# EasyEDA Pro project ProPrj_智能视觉集成板-V3.0.epro, schematic 双驱

## Sheets
1 母驱 连接器: Board Name: 双驱板; Create Date: 2025-04-21; Page Name: 母驱 连接器; Project Name: 009-智能视觉集成板-V2.0; Schematic Name: 双驱; Update Date: 2025-05-03; Company: 嘉立创EDA; Page Size: A4; Version: V1.0
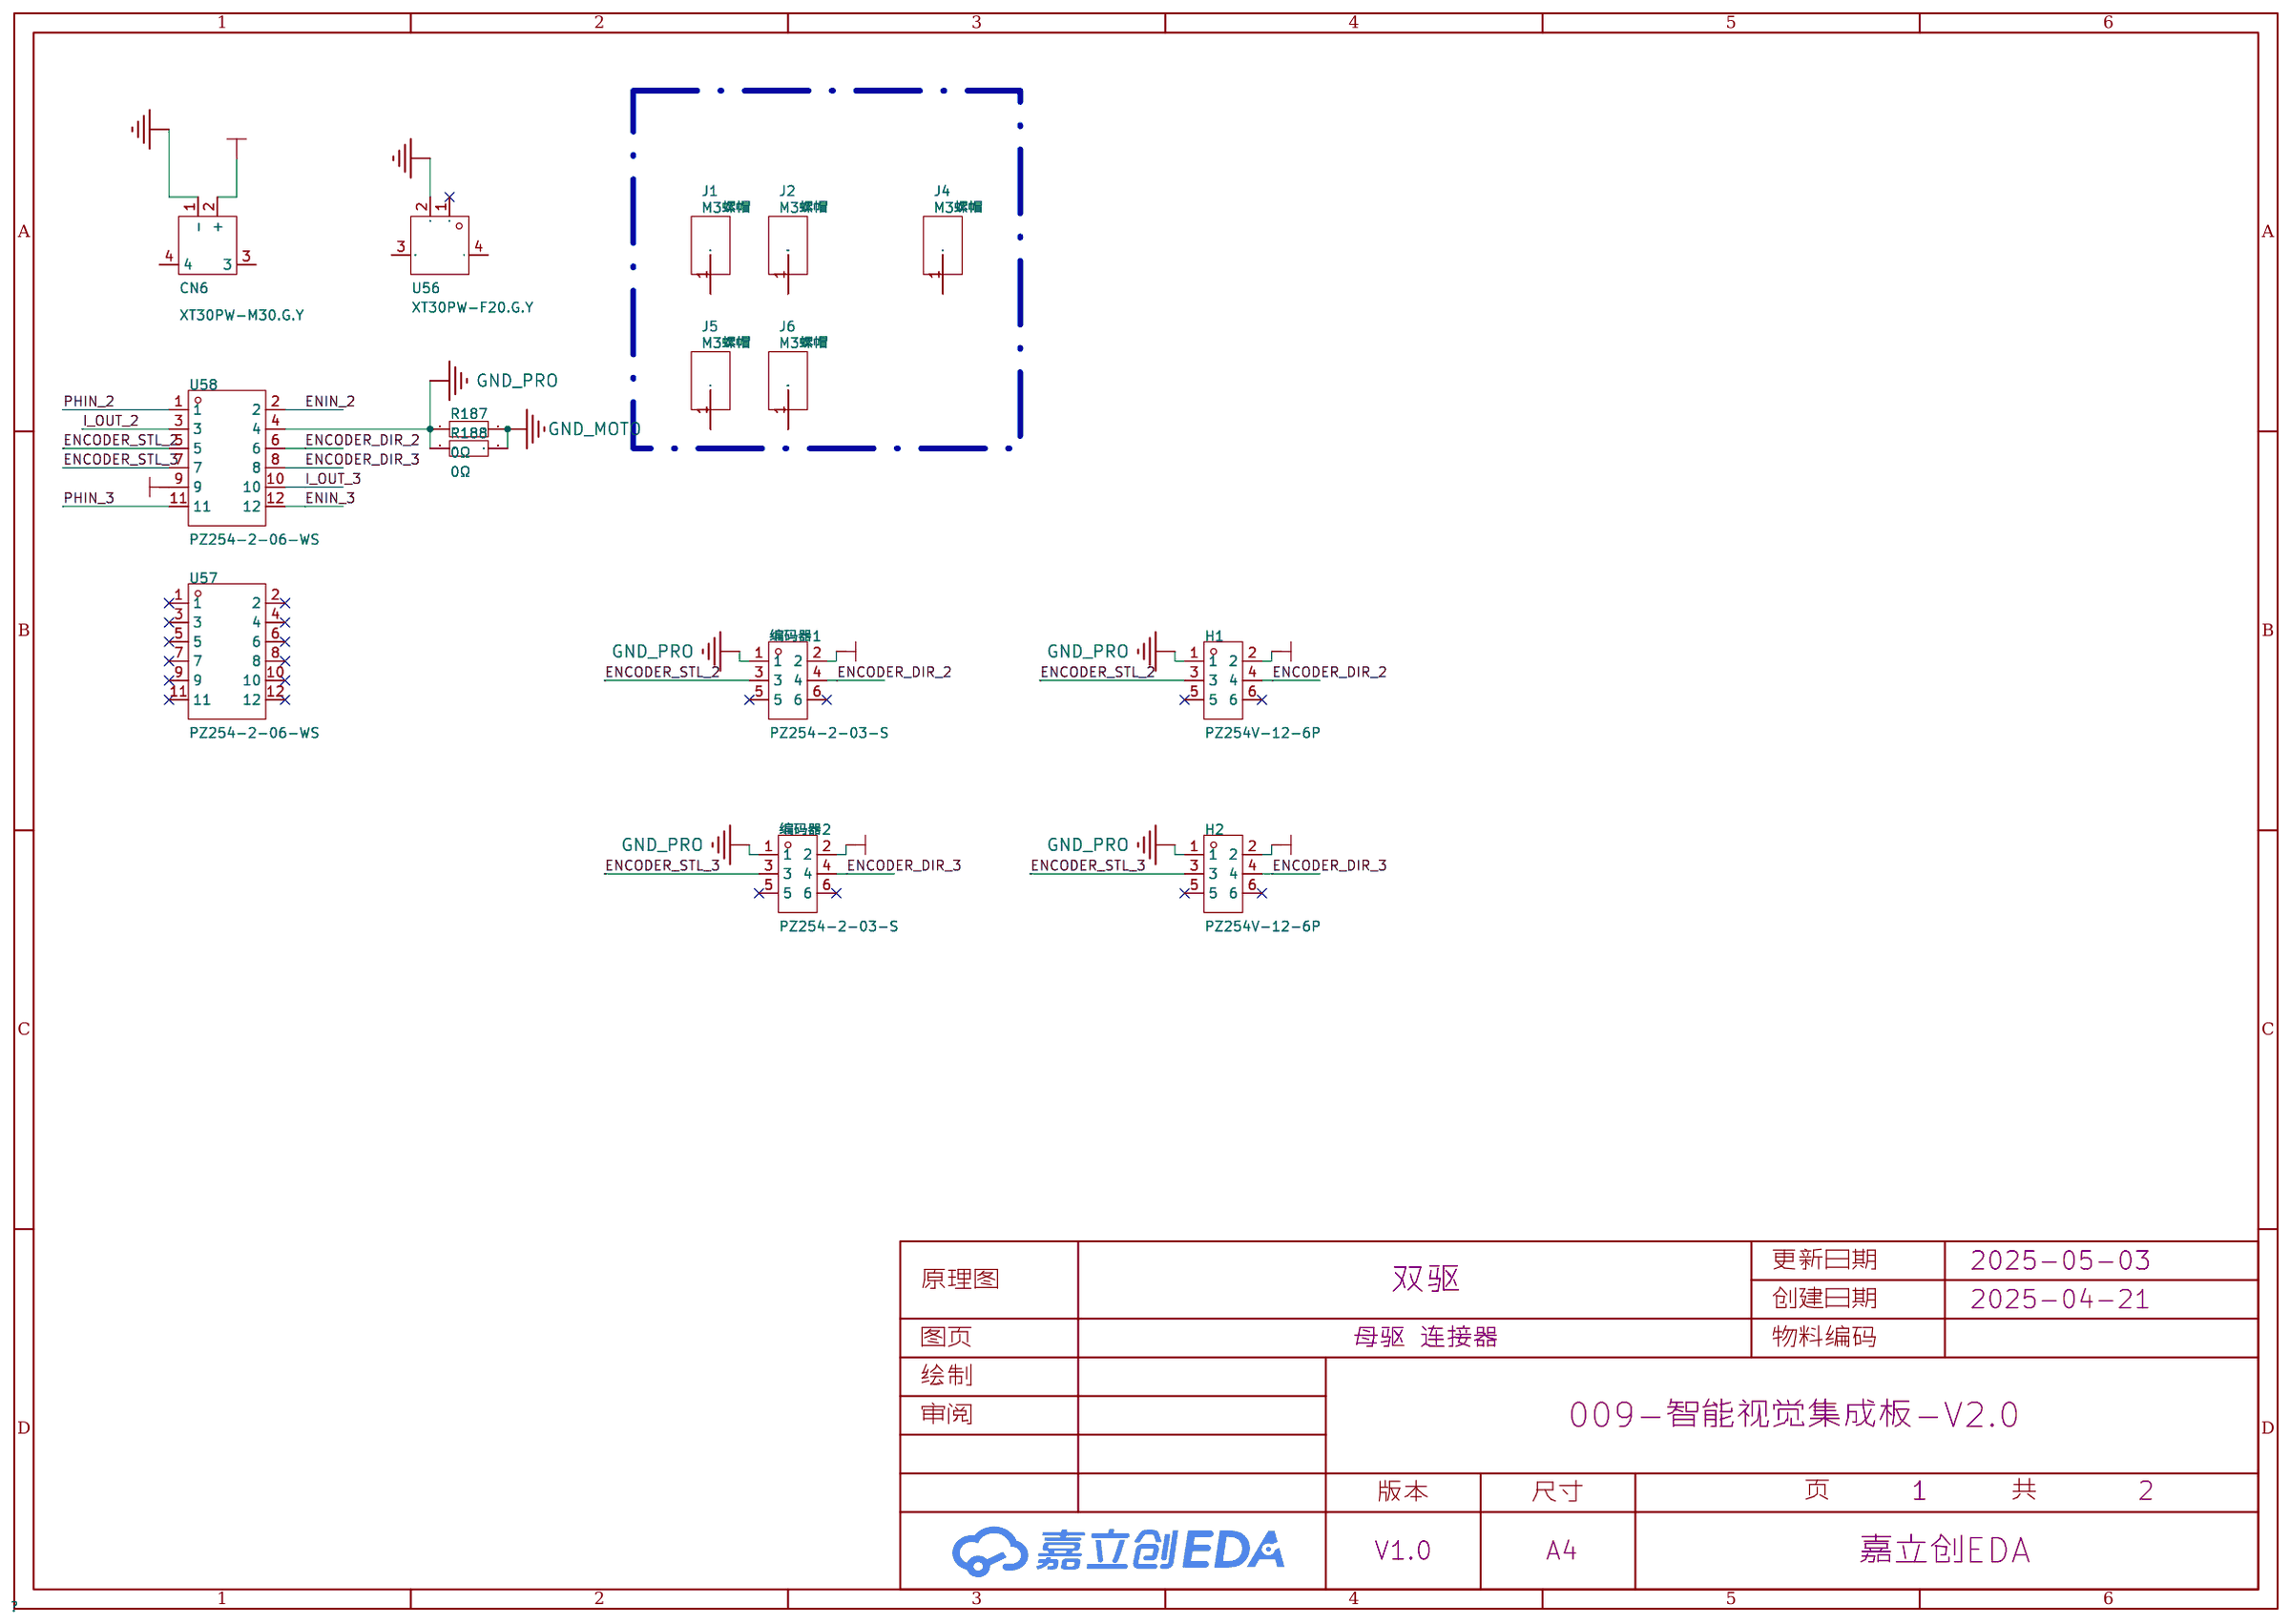
[diagram p15: 母驱 连接器]
2 双驱: Create Date: 2025-06-25; Page Name: 双驱; Project Name: 009-智能视觉集成板-V3.0; Update Date: 2025-06-25
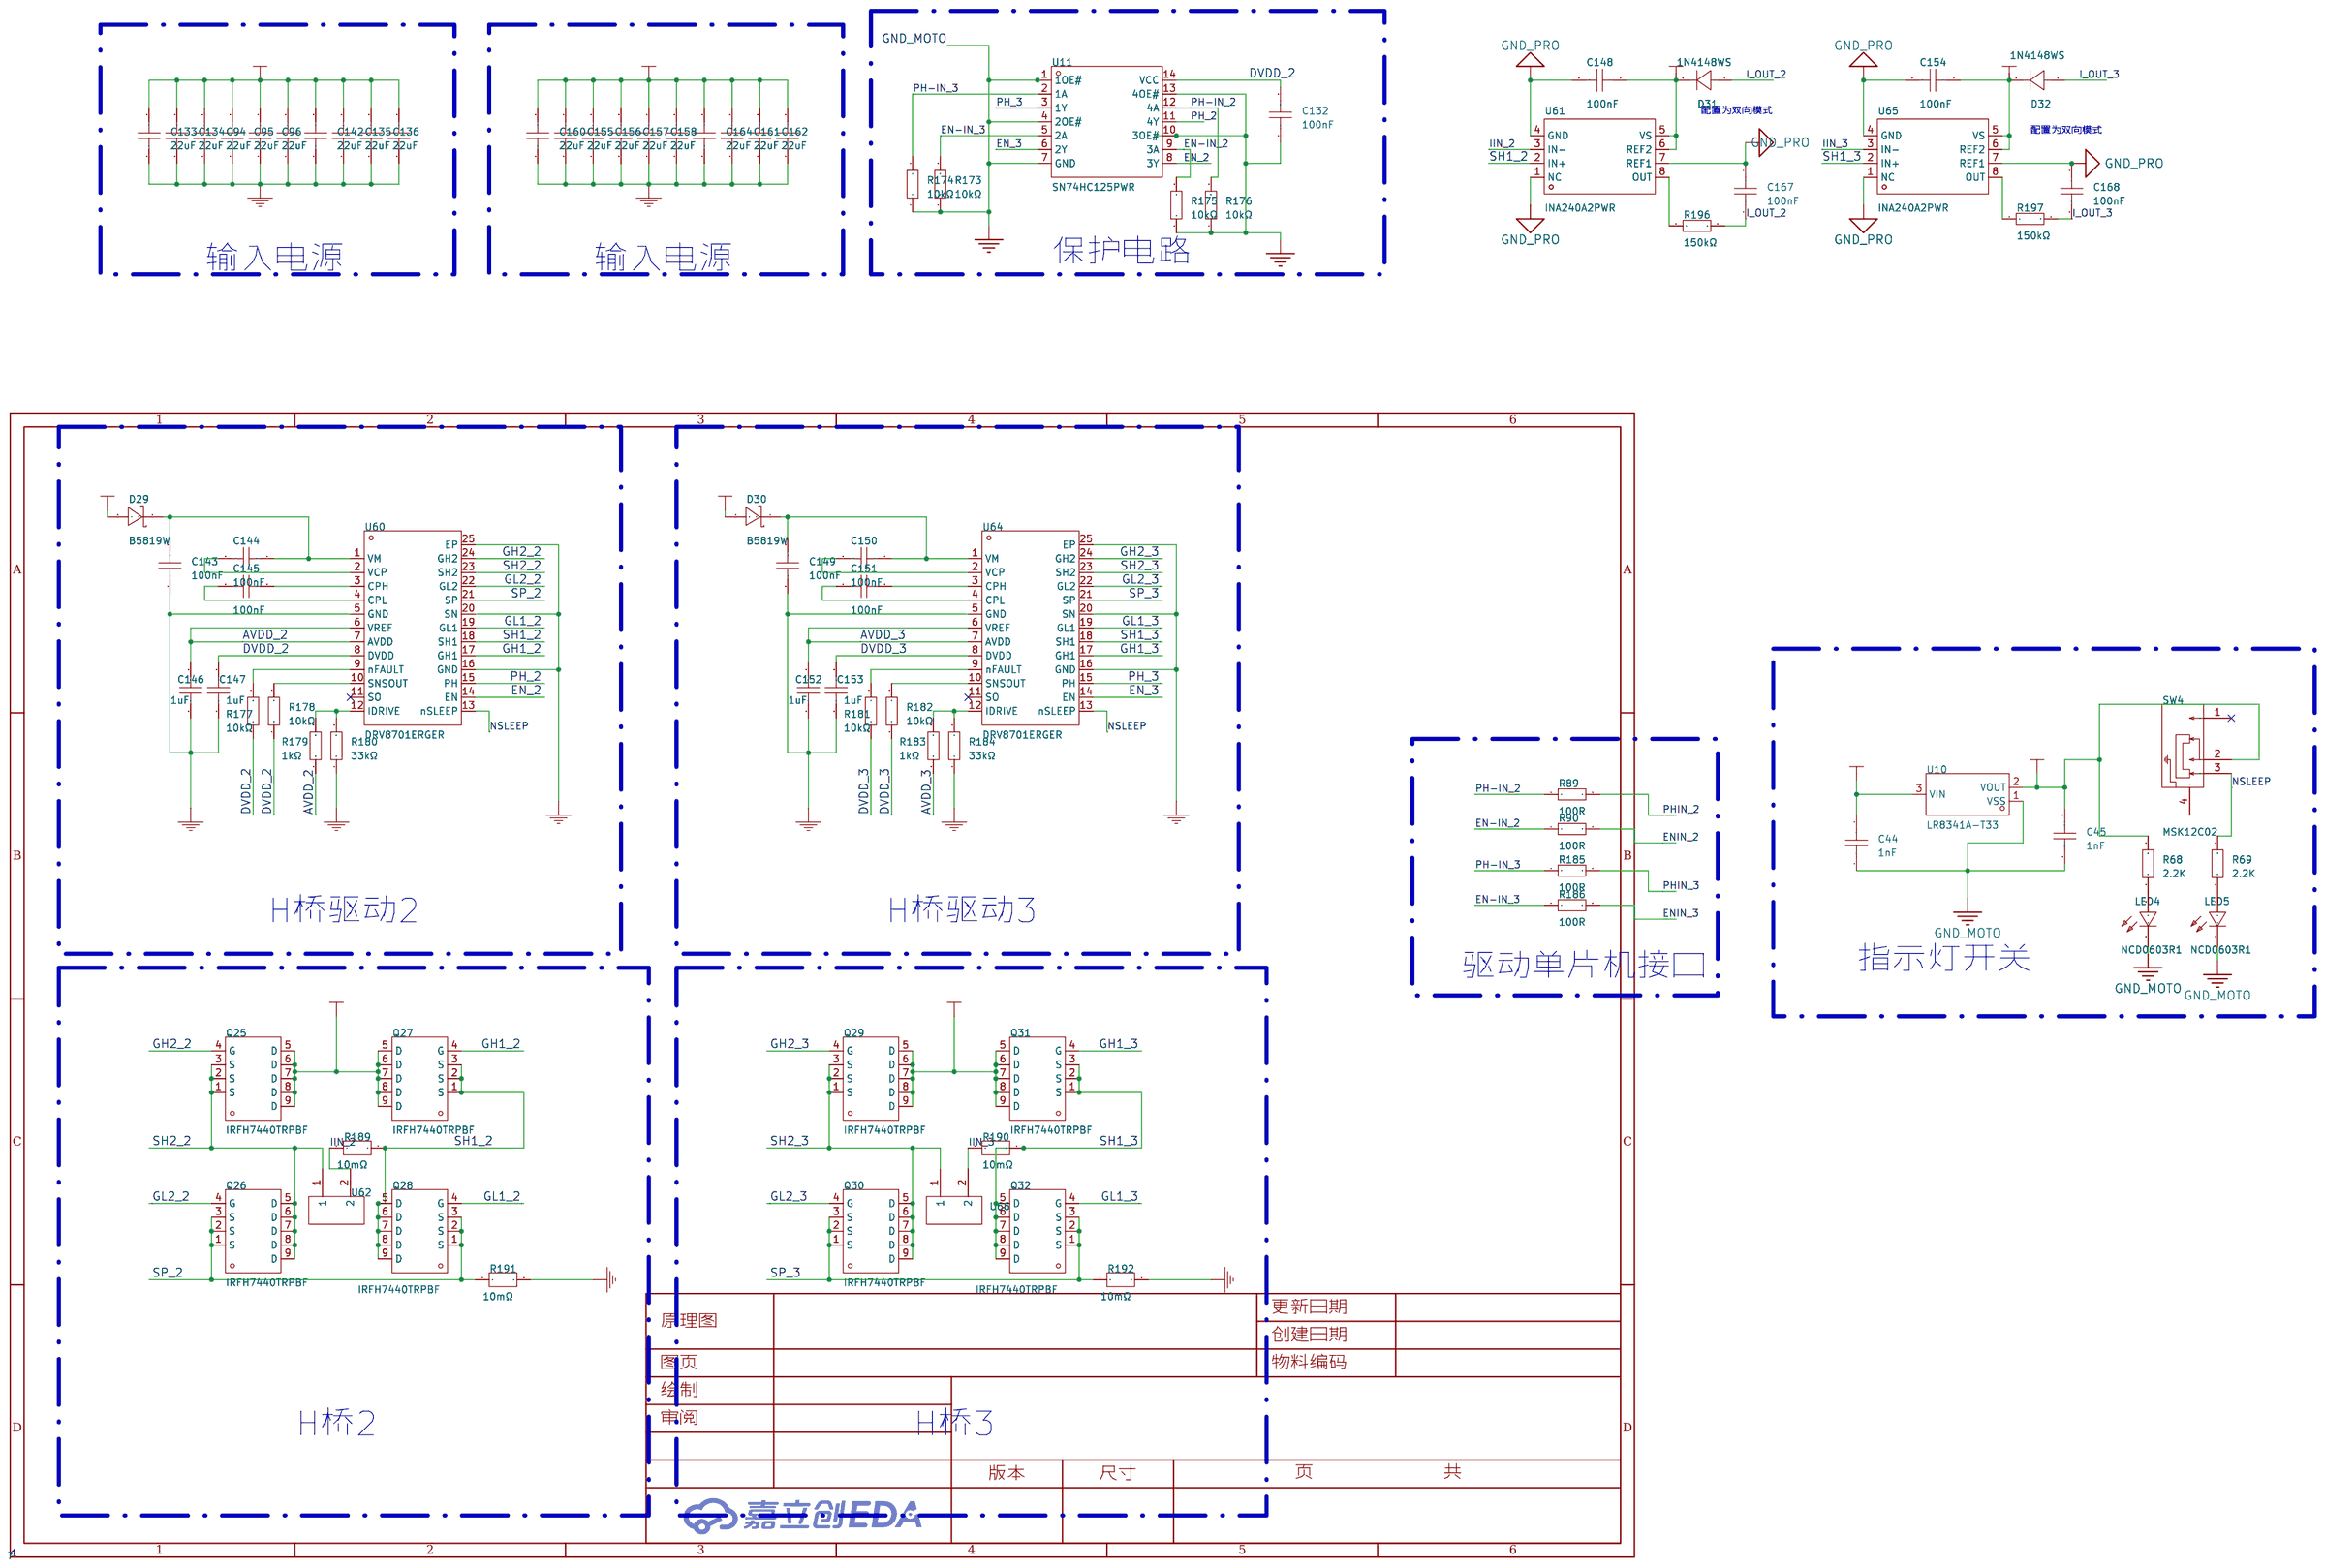
[diagram p16: 双驱]

## Parts
sheet 双驱
C44  1nF  [C0603]
C45  1nF  [C0603]
C94  22uF  [c1206]
C95  22uF  [c1206]
C96  22uF  [c1206]
C97  22uF  [c1206]
C132  100nF  [C0603]
C133  22uF  [c1206]
C134  22uF  [c1206]
C135  22uF  [c1206]
C136  22uF  [c1206]
C137  22uF  [c1206]
C142  22uF  [c1206]
C143  100nF  [C0402]
C144  100nF  [C0402]
C145  100nF  [C0402]
C146  1uF  [C0402]
C147  1uF  [C0402]
C148  100nF  [C0402]
C149  100nF  [C0402]
C150  100nF  [C0402]
C151  100nF  [C0402]
C152  1uF  [C0402]
C153  1uF  [C0402]
C154  100nF  [C0402]
C155  22uF  [c1206]
C156  22uF  [c1206]
C157  22uF  [c1206]
C158  22uF  [c1206]
C159  22uF  [c1206]
C160  22uF  [c1206]
C161  22uF  [c1206]
C162  22uF  [c1206]
C163  22uF  [c1206]
C164  22uF  [c1206]
C167  100nF  [C0402]
C168  100nF  [C0402]
D29  B5819W  [SOD-123_L2.8-W1.8-LS3.7-RD]
D30  B5819W  [SOD-123_L2.8-W1.8-LS3.7-RD]
D31  1N4148WS  [SOD-323_L1.7-W1.3-LS2.5-FD]
D32  1N4148WS  [SOD-323_L1.7-W1.3-LS2.5-FD]
LED4  NCD0603R1  [LED0603-RD_RED]
LED5  NCD0603R1  [LED0603-RD_RED]
Q25  IRFH7440TRPBF  [DFN-8_L5.8-W4.9-P1.27-LS6.0-BL-1]
Q26  IRFH7440TRPBF  [DFN-8_L5.8-W4.9-P1.27-LS6.0-BL-1]
Q27  IRFH7440TRPBF  [DFN-8_L5.8-W4.9-P1.27-LS6.0-BL-1]
Q28  IRFH7440TRPBF  [DFN-8_L5.8-W4.9-P1.27-LS6.0-BL-1]
Q29  IRFH7440TRPBF  [DFN-8_L5.8-W4.9-P1.27-LS6.0-BL-1]
Q30  IRFH7440TRPBF  [DFN-8_L5.8-W4.9-P1.27-LS6.0-BL-1]
Q31  IRFH7440TRPBF  [DFN-8_L5.8-W4.9-P1.27-LS6.0-BL-1]
Q32  IRFH7440TRPBF  [DFN-8_L5.8-W4.9-P1.27-LS6.0-BL-1]
R68  2.2K  [R0603]
R69  2.2K  [R0603]
R89  100R  [R0603]
R90  100R  [R0603]
R173  10kΩ  [R0603]
R174  10kΩ  [R0603]
R175  10kΩ  [R0603]
R176  10kΩ  [R0603]
R177  10kΩ  [R0402]
R178  10kΩ  [R0402]
R179  1kΩ  [R0402]
R180  33kΩ  [R0402]
R181  10kΩ  [R0402]
R182  10kΩ  [R0402]
R183  1kΩ  [R0402]
R184  33kΩ  [R0402]
R185  100R  [R0603]
R186  100R  [R0603]
R189  10mΩ  [R1206]
R190  10mΩ  [R1206]
R191  10mΩ  [R1206]
R192  10mΩ  [R1206]
R196  150kΩ  [R0402]
R197  150kΩ  [R0402]
SW4  MSK12C02  [SW-TH_MSK12C02]
U10  LR8341A-T33  [SOT-23-3L_L2.9-W1.6-P1.90-LS2.8-BL]
U11  SN74HC125PWR  [TSSOP-14_L5.0-W4.4-P0.65-LS6.5-BL]
U60  DRV8701ERGER  [VQFN-24_L4.0-W4.0-P0.50-BL-EP2.5]
U61  INA240A2PWR  [TSSOP-8_L4.4-W3.0-P0.65-LS6.4-BL]
U62  -  [2P焊接端子（大电流）]
U64  DRV8701ERGER  [VQFN-24_L4.0-W4.0-P0.50-BL-EP2.5]
U65  INA240A2PWR  [TSSOP-8_L4.4-W3.0-P0.65-LS6.4-BL]
U66  -  [2P焊接端子（大电流）]
sheet 母驱 连接器
CN6  XT30PW-M30.G.Y  [CONN-TH_XT30PW-M]
H1  PZ254V-12-6P  [HDR-TH_6P-P2.54-V-M-R2-C3-S2.54]
H2  PZ254V-12-6P  [HDR-TH_6P-P2.54-V-M-R2-C3-S2.54]
J1  M3螺帽  [M3螺帽]
J2  M3螺帽  [M3螺帽]
J4  M3螺帽  [M3螺帽]
J5  M3螺帽  [M3螺帽]
J6  M3螺帽  [M3螺帽]
R187  0Ω  [R0603]
R188  0Ω  [R0603]
U56  XT30PW-F20.G.Y  [CONN-TH_XT30PW-F-1]
U57  PZ254-2-06-WS  [HDR-SMD_12P-P2.54_HCTL_PZ254-2-06-WS]
U58  PZ254-2-06-WS  [HDR-SMD_12P-P2.54_HCTL_PZ254-2-06-WS]
编码器1  PZ254-2-03-S  [HDR-SMD_6P-P2.54-V-M-R2-C3-LS7.5-2]
编码器2  PZ254-2-03-S  [HDR-SMD_6P-P2.54-V-M-R2-C3-LS7.5-2]

## Library data of the parts
C44 C45 = CAP_0603: Supplier Footprint: 0603
C94-C97 C133-C137 C142 C155-C164 = CGA1206X5R226M350NT: 容值:22uF;精度:±20%;额定电压:35V;材质(温度系数):X5R;; LCSC Part Name: 22uF ±20% 35V; Supplier Part: C6119969; Manufacturer: HRE(芯声); Supplier Footprint: 1206; JLCPCB Part Class: 扩展库; Supplier: LCSC; Tolerance: ±20%; Voltage Rated: 35V; Temperature Coefficient: X5R
C132 = CGA0603X7R104K500JT: 容值:100nF;精度:±10%;额定电压:50V;材质(温度系数):X7R;; LCSC Part Name: 100nF ±10% 50V; Supplier Part: C6119867; Manufacturer: HRE(芯声); Supplier Footprint: 0603; JLCPCB Part Class: 扩展库; Supplier: LCSC; Tolerance: ±10%; Voltage Rated: 50V; Temperature Coefficient: X7R
C143-C145 C148-C151 C154 C167 C168 = CL05B104KB54PNC: 容值:100nF;精度:±10%;额定电压:50V;材质(温度系数):X7R;; LCSC Part Name: 100nF ±10% 50V; Supplier Part: C307331; Manufacturer: SAMSUNG(三星); Supplier Footprint: 0402; JLCPCB Part Class: 基础库; Datasheet: https://atta.szlcsc.com/upload/public/pdf/source/20160218/1457707763339.pdf; Supplier: LCSC; Tolerance: ±10%; Voltage Rated: 50V; Temperature Coefficient: X7R
C146 C147 C152 C153 = GRM155R61H105KE05D: 容值:1uF;精度:±10%;额定电压:50V;材质(温度系数):X5R;; LCSC Part Name: 1uF ±10% 50V; Supplier Part: C1518208; Manufacturer: muRata(村田); Supplier Footprint: 0402; JLCPCB Part Class: 扩展库; Datasheet: https://atta.szlcsc.com/upload/public/pdf/source/20210607/3F03D47137F6EC7729AB4067EB2A6EB3.pdf; Supplier: LCSC; Tolerance: ±10%; Voltage Rated: 50V; Temperature Coefficient: X5R
D29 D30 = B5819W_C64885: 二极管配置:独立式;正向压降(Vf):900mV@3A;直流反向耐压(Vr):40V;整流电流:1A;; LCSC Part Name: 电压:40V 电流:1A; Supplier Part: C64885; Manufacturer: MDD(辰达半导体); Supplier Footprint: SOD-123; JLCPCB Part Class: 扩展库; Datasheet: https://atta.szlcsc.com/upload/public/pdf/source/20230823/08094EB15E96CCD3558B35DDD25E45C2.pdf; Supplier: LCSC; Diode Configuration: 独立式; Forward Voltage (Vf@If): 900mV@3A; Reverse Voltage (Vr): 40V; Rectified Current: 1A; Reverse Leakage Current (Ir): 1mA@40V
D31 D32 = 1N4148WS_C7420319: 二极管配置:独立式;正向压降(Vf):1.25V@150mA;直流反向耐压(Vr):100V;整流电流:150mA;反向恢复时间(trr):4ns;; Supplier Part: C7420319; Manufacturer: 宏迦橙; Supplier Footprint: SOD-323; JLCPCB Part Class: 扩展库; Datasheet: https://atta.szlcsc.com/upload/public/pdf/source/20240228/ACAE8A2B901F2FD417588BC59863BC16.pdf; Supplier: LCSC; Diode Configuration: 独立式; Forward Voltage (Vf@If): 1.25V@150mA; Reverse Voltage (Vr): 100V; Rectified Current: 150mA; Reverse Leakage Current (Ir): 1uA@75V; Reverse Recovery Time (trr): 4ns; Operating Temperature: -55℃~+150℃
LED4 LED5 = NCD0603R1_C84263: 灯头类型:-;发光颜色:红色;正向电压(VF):1.6V~2.6V;功率:65mW;正向电流:20mA;主波长:615nm~630nm;二极管配置:独立二极管;透镜颜色:无色透明透镜;色温:-;发光强度:80mcd~220mcd;发光角度:130°;载带方式:-;工作温度:-30℃~+85℃;; Supplier Part: C84263; Manufacturer: 国星光电; Supplier Footprint: 0603; JLCPCB Part Class: 扩展库; Datasheet: https://atta.szlcsc.com/upload/public/pdf/source/20200820/C84263_DABC6A75E58F576973B407FDBA283D60.pdf; Supplier: LCSC; Emitted Color: 红色; Forward Voltage (VF): 1.6V~2.6V; Power Dissipation: 65mW; Forward Current: 20mA; Dominant Wavelength: 615nm~630nm; Diode Configuration: 独立二极管; Lens Color: 无色透明透镜; Luminous Intensity: 80mcd~220mcd; Viewing Angle: 130°; Operating Temperature: -30℃~+85℃
Q25-Q32 = IRFH7440TRPBF: 类型:N沟道;漏源电压(Vdss):40V;连续漏极电流(Id):85A;功率(Pd):104W;导通电阻(RDS(on)@Vgs,Id):2.4mΩ@10V,50A;阈值电压(Vgs(th)@Id):3.9V@100uA;; LCSC Part Name: N沟道 耐压:40V 电流:85A; Supplier Part: C67862; Manufacturer: Infineon(英飞凌); Supplier Footprint: PQFN(5x6); JLCPCB Part Class: 扩展库; Datasheet: https://atta.szlcsc.com/upload/public/pdf/source/20190419/C386359_273C98C00830BF5419F9D4766EDDF693.pdf; Supplier: LCSC; Type: N沟道; Drain Source Voltage (Vdss): 40V; Continuous Drain Current (Id): 85A; Power Dissipation (Pd): 104W; Drain Source On Resistance (RDS(on)@Vgs,Id): 2.4mΩ@10V,50A; Gate Threshold Voltage (Vgs(th)@Id): 3.9V@100uA; Total Gate Charge (Qg@Vgs): 138nC@10V; Input Capacitance (Ciss@Vds): 4.574nF@25V; Operating Temperature: -55℃~+150℃@(Tj)
R68 R69 R89 R90 R185 R186 = Res_0603: Supplier Footprint: 0603
R173-R176 = 0603WAF1002T5E: 电阻类型:厚膜电阻;阻值:10kΩ;精度:±1%;功率:100mW;最大工作电压:75V;温度系数:±100ppm/℃;; LCSC Part Name: 厚膜电阻 10kΩ ±1% 100mW; Supplier Part: C25804; Manufacturer: UNI-ROYAL(厚声); Supplier Footprint: 0603; JLCPCB Part Class: 基础库; Datasheet: https://atta.szlcsc.com/upload/public/pdf/source/20200306/C422600_1E6D84923E4A46A82E41ADD87F860B5C.pdf; Supplier: LCSC; Type: 厚膜电阻; Tolerance: ±1%; Power(Watts): 100mW; Overload Voltage (Max): 75V; Temperature Coefficient: ±100ppm/℃; Operating Temperature Range: -55℃~+155℃
R177 R178 R181 R182 = 0402WGF1002TCE: 电阻类型:厚膜电阻;阻值:10kΩ;精度:±1%;功率:62.5mW;最大工作电压:50V;温度系数:±100ppm/℃;; LCSC Part Name: 10kΩ ±1% 62.5mW 厚膜电阻; Supplier Part: C25744; Manufacturer: UNI-ROYAL(厚声); Supplier Footprint: 0402; JLCPCB Part Class: 基础库; Datasheet: https://atta.szlcsc.com/upload/public/pdf/source/20200306/C422600_1E6D84923E4A46A82E41ADD87F860B5C.pdf; Supplier: LCSC; Type: 厚膜电阻; Tolerance: ±1%; Power(Watts): 62.5mW; Overload Voltage (Max): 50V; Temperature Coefficient: ±100ppm/℃; Operating Temperature Range: -55℃~+155℃
R179 R183 = 0402WGF1001TCE: 电阻类型:厚膜电阻;阻值:1kΩ;精度:±1%;功率:62.5mW;最大工作电压:50V;温度系数:±100ppm/℃;; LCSC Part Name: 1kΩ ±1% 62.5mW 厚膜电阻; Supplier Part: C11702; Manufacturer: UNI-ROYAL(厚声); Supplier Footprint: 0402; JLCPCB Part Class: 基础库; Datasheet: https://atta.szlcsc.com/upload/public/pdf/source/20200306/C422600_1E6D84923E4A46A82E41ADD87F860B5C.pdf; Supplier: LCSC; Type: 厚膜电阻; Tolerance: ±1%; Power(Watts): 62.5mW; Overload Voltage (Max): 50V; Temperature Coefficient: ±100ppm/℃; Operating Temperature Range: -55℃~+155℃
R180 R184 = 0402WGF3302TCE: 电阻类型:厚膜电阻;阻值:33kΩ;精度:±1%;功率:62.5mW;最大工作电压:50V;温度系数:±100ppm/℃;; LCSC Part Name: 33kΩ ±1% 62.5mW 厚膜电阻; Supplier Part: C25779; Manufacturer: UNI-ROYAL(厚声); Supplier Footprint: 0402; JLCPCB Part Class: 基础库; Datasheet: https://atta.szlcsc.com/upload/public/pdf/source/20200306/C422600_1E6D84923E4A46A82E41ADD87F860B5C.pdf; Supplier: LCSC; Type: 厚膜电阻; Tolerance: ±1%; Power(Watts): 62.5mW; Overload Voltage (Max): 50V; Temperature Coefficient: ±100ppm/℃; Operating Temperature Range: -55℃~+155℃
R189-R192 = JER1206F1R010: 电阻类型:采样电阻;阻值:10mΩ;精度:±1%;功率:1W;温度系数:±50ppm/℃;; LCSC Part Name: 10mΩ 1W 1206 ±1%; Supplier Part: C46634437; Manufacturer: 捷而瑞; Supplier Footprint: 1206; JLCPCB Part Class: 扩展库; Datasheet: https://atta.szlcsc.com/upload/public/pdf/source/20250318/D554CC95569B02A455FAE3D181D671EA.pdf; Supplier: LCSC; Type: 采样电阻; Tolerance: ±1%; Power(Watts): 1W; Temperature Coefficient: ±50ppm/℃
R196 R197 = 0402WGF1503TCE: 电阻类型:厚膜电阻;阻值:150kΩ;精度:±1%;功率:62.5mW;最大工作电压:50V;温度系数:±100ppm/℃;; LCSC Part Name: 150kΩ ±1% 62.5mW 厚膜电阻; Supplier Part: C25755; Manufacturer: UNI-ROYAL(厚声); Supplier Footprint: 0402; JLCPCB Part Class: 扩展库; Datasheet: https://atta.szlcsc.com/upload/public/pdf/source/20200306/C422600_1E6D84923E4A46A82E41ADD87F860B5C.pdf; Supplier: LCSC; Type: 厚膜电阻; Tolerance: ±1%; Power(Watts): 62.5mW; Overload Voltage (Max): 50V; Temperature Coefficient: ±100ppm/℃; Operating Temperature Range: -55℃~+155℃
SW4 = MSK12C02: 电路结构:单刀双掷;安装方式:卧贴;开关颜色:-;额定电流(DC):50mA;额定电压(DC):12V;额定电流(AC):-;额定电压(AC):-;机械寿命:1万次;; LCSC Part Name: 两档侧拨贴片 7脚 滑动开关; Supplier Part: C431540; Manufacturer: SHOU HAN(首韩); Supplier Footprint: SMD; JLCPCB Part Class: 扩展库; Datasheet: https://atta.szlcsc.com/upload/public/pdf/source/20190925/C431540_89155AEF0758B9AD1B2D805F83FB12E3.pdf; Supplier: LCSC; Circuit: 单刀双掷; Pin Style: SMD接片; Switch Length: 8mm; Switch Width: 2.8mm; Switch Height: 1.4mm; Mounting Style: 卧贴; Current Rating (DC): 50mA; Voltage Rating (DC): 12V; Mechanical Life: 1万次; Operating Temperature: -20℃~+70℃
U10 = LR8341A-T33: 输出类型:固定;最大输入电压:40V;输出电压:3.3V;最大输出电流:100mA;电源纹波抑制比(PSRR):55dB@(1kHz);输出极性:正极;; LCSC Part Name: 输入40V 输出3.3V 100mA; Supplier Part: C2829465; Manufacturer: LR(朗瑞); Supplier Footprint: SOT-23-3L; JLCPCB Part Class: 扩展库; Datasheet: https://atta.szlcsc.com/upload/public/pdf/source/20210426/C2829465_61F15D7ACE9671B48D4F69A8092B0D8F.pdf; Supplier: LCSC; Output Type: 固定; Maximum Input Voltage: 40V; Output Voltage: 3.3V; MAX Output Current: 100mA; Power Supply Rejection Ratio (PSRR): 55dB@(1kHz); standby current: 2uA; Operating Temperature: -40℃~+85℃; Output Polarity: 正极; Number of Outputs: 1
U11 = SN74HC125PWR: 输入类型:-;电源电压:2V~6V;元件数:4;每个元件位数:1;灌电流(IOL):7.8mA;拉电流(IOH):7.8mA;; Supplier Part: C132994; Manufacturer: TI(德州仪器); Supplier Footprint: TSSOP-14; JLCPCB Part Class: Extended Part; Datasheet: https://www.ti.com/cn/lit/gpn/sn74hc125; Supplier: LCSC; output type: 三态; Supply Voltage: 2V~6V; Number of Elements: 4; Number of Bits per Element: 1; Sink Current: 7.8mA; Source Current: 7.8mA; Logic Family: 74HC; Operating Temperature: -40℃~+85℃
U60 U64 = DRV8701ERGER: DRV8701 47V H 桥智能栅极驱动器; LCSC Part Name: 有刷直流电机驱动芯片 45V; Supplier Part: C90964; Manufacturer: TI(德州仪器); Supplier Footprint: VQFN-24-EP(4x4); JLCPCB Part Class: 扩展库; Datasheet: https://www.ti.com/cn/lit/gpn/drv8701; Supplier: LCSC
U61 U65 = INA240A2PWR: 放大器数:单路;; Supplier Part: C129949; Manufacturer: TI(德州仪器); Supplier Footprint: TSSOP-8; JLCPCB Part Class: 扩展库; Datasheet: https://www.ti.com/cn/lit/gpn/ina240; Supplier: LCSC; Number of Channels: 单路; Supply Current: 1.8mA; Operating Temperature: -40℃~+125℃
U62 U66 = 大电流焊接端子
CN6 = XT30PW-M30.G.Y: 类别:-;类型1:-;; LCSC Part Name: AMASS(艾迈斯)航模插头 卧式弯脚 XT30PW-M公头; Supplier Part: C431092; Manufacturer: AMASS(艾迈斯); JLCPCB Part Class: 扩展库; Datasheet: https://atta.szlcsc.com/upload/public/pdf/source/20220222/6A9F22F7850E25B33E1BE430ADF8560B.pdf; Supplier: LCSC; Type: 航模插头; RatedVoltage: DC 500V; InterfaceType: 公头; RatedCurrent: 15A; RecommendedWireGauge: 16/18/20AWG; contact resistance: 1.2mΩ; specifications: 2pin
H1 H2 = PZ254V-12-6P: 插针结构:2x3P;间距:2.54mm;行距:2.54mm;圆针/方针:方针;安装类型:直插;排数:双排;总PIN位数:6P;额定电流:-;额定电压:-;配合针长度:6mm;塑高:2.5mm;端接针长度:3mm;触头材质:黄铜;触头镀层:-;工作温度范围:-40℃~+105℃;颜色:黑色;; LCSC Part Name: 间距:2.54mm 2x3P 直插 方针; Supplier Part: C492420; Manufacturer: XFCN(兴飞); Supplier Footprint: 插件,P=2.54mm; JLCPCB Part Class: 扩展库; Datasheet: https://atta.szlcsc.com/upload/public/pdf/source/20200309/C492420_BAECB307B001054C09D200388220EAE6.pdf; Supplier: LCSC; Pin Structure: 2x3P; Pitch: 2.54mm; Row Spacing: 2.54mm; Circluar Pins/Square Pins: 方针; Mounting Type: 直插; Number of Rows: 双排; Number of Pins: 6P; Length of Mating Pin: 6mm; Insulation Height: 2.5mm; Length of End Connection Pin: 3mm; Contact Material: 黄铜; Operating Temperature Range: -40℃~+105℃; Color: 黑色
J1 J2 J4-J6 = M3螺帽
R187 R188 = 0603WAF0000T5E: 电阻类型:厚膜电阻;阻值:0Ω;精度:±1%;功率:100mW;最大工作电压:75V;; LCSC Part Name: 0Ω ±1% 100mW 厚膜电阻; Supplier Part: C21189; Manufacturer: UNI-ROYAL(厚声); Supplier Footprint: 0603; JLCPCB Part Class: 基础库; Datasheet: https://atta.szlcsc.com/upload/public/pdf/source/20200306/C422600_1E6D84923E4A46A82E41ADD87F860B5C.pdf; Supplier: LCSC; Type: 厚膜电阻; Tolerance: ±1%; Power(Watts): 100mW; Overload Voltage (Max): 75V; Operating Temperature Range: -55℃~+155℃
U56 = XT30PW-F20.G.Y: 类别:-;类型1:-;; LCSC Part Name: AMASS(艾迈斯)电源连接器 母头 XT30PW-F; Supplier Part: C2913282; Manufacturer: AMASS(艾迈斯); JLCPCB Part Class: 扩展库; Datasheet: https://atta.szlcsc.com/upload/public/pdf/source/20231218/06CFCF98887A9A87638B0856A725C8FD.pdf; Supplier: LCSC; Type: 航模插头; InterfaceType: 母头
U57 U58 = PZ254-2-06-WS: 插针结构:2x6P;间距:2.54mm;行距:2.54mm;圆针/方针:方针;安装类型:卧贴;排数:双排;总PIN位数:12P;额定电流:3A;额定电压:-;配合针长度:6mm;塑高:2.5mm;端接针长度:-;工作温度范围:-40℃~+105℃;焊接温度(最大值):260℃@10S;颜色:黑色;; LCSC Part Name: 2x6P 间距:2.54mm 方针 卧贴 黑色; Supplier Part: C5149356; Manufacturer: HCTL(华灿天禄); Supplier Footprint: SMD,P=2.54mm,卧贴; JLCPCB Part Class: 扩展库; Datasheet: https://atta.szlcsc.com/upload/public/pdf/source/20230609/395CF6299CB3DEE695290492722C7F5B.pdf; Supplier: LCSC; Pin Structure: 2x6P; Pitch: 2.54mm; Row Spacing: 2.54mm; Circluar Pins/Square Pins: 方针; Mounting Type: 卧贴; Number of Rows: 双排; Number of Pins: 12P; Current Rating (Max): 3A; Length of Mating Pin: 6mm; Insulation Height: 2.5mm; Operating Temperature Range: -40℃~+105℃; Soldering Temperature(Max): 260℃@10S; Color: 黑色
编码器1 编码器2 = PZ254-2-03-S: 插针结构:2x3P;间距:2.54mm;行距:2.54mm;圆针/方针:方针;安装类型:立贴;排数:双排;总PIN位数:6P;额定电流:3A;额定电压:250V;配合针长度:6mm;塑高:2.5mm;端接针长度:-;工作温度范围:-40℃~+105℃;焊接温度(最大值):260℃@5S;颜色:黑色;; LCSC Part Name: 2x3P 间距:2.54mm 方针 立贴 黑色; Supplier Part: C3294461; Manufacturer: HCTL(华灿天禄); Supplier Footprint: SMD,P=2.54mm; JLCPCB Part Class: 扩展库; Datasheet: https://atta.szlcsc.com/upload/public/pdf/source/20230609/FB2B5B924AA338E6CB93C3BD1D012B72.pdf; Supplier: LCSC; Pin Structure: 2x3P; Pitch: 2.54mm; Row Spacing: 2.54mm; Circluar Pins/Square Pins: 方针; Mounting Type: 立贴; Number of Rows: 双排; Number of Pins: 6P; Current Rating (Max): 3A; Voltage Rating (Max): 250V; Length of Mating Pin: 6mm; Insulation Height: 2.5mm; Operating Temperature Range: -40℃~+105℃; Soldering Temperature(Max): 260℃@5S; Color: 黑色

## Nets
+3V3: C45.2 R68.2 SW4.2 U10.2(VOUT)
AVDD_2: C146.2 R179.1 U60.6(VREF) U60.7(AVDD)
AVDD_3: C152.2 R183.1 U64.6(VREF) U64.7(AVDD)
DVDD_2: C132.2 C147.2 R177.1 R178.1 U11.14(VCC) U60.8(DVDD)
DVDD_3: C153.2 R181.1 R182.1 U64.8(DVDD)
GND_MOTO: C44.1 C45.1 C94.1 C95.1 C96.1 C97.1 C132.1 C133.1 C134.1 C135.1 C136.1 C137.1 C142.1 C143.1 C146.1 C147.1 C149.1 C152.1 C153.1 C155.1 C156.1 C157.1 C158.1 C159.1 C160.1 C161.1 C162.1 C163.1 C164.1 CN6.1(-) LED4.1(K) LED5.1(K) R173.1 R174.1 R175.1 R176.1 R180.1 R184.1 R187.2 R188.2 R191.2 R192.2 U10.1(VSS) U11.1(1OE#) U11.4(2OE#) U11.7(GND) U11.10(3OE#) U11.13(4OE#) U56.2 U60.5(GND) U60.16(GND) U60.20(SN) U60.25(EP) U64.5(GND) U64.16(GND) U64.20(SN) U64.25(EP)
GND_PRO: C148.2 C154.2 C167.1 C168.1 H1.1 H2.1 R187.1 R188.1 U58.4 U61.1(NC) U61.4(GND) U61.7(REF1) U65.1(NC) U65.4(GND) U65.7(REF1) 编码器1.1 编码器2.1
VCC_3V3: C148.1 C154.1 D31.2(K) D32.2(K) H1.2 H2.2 U58.9 U61.5(VS) U61.6(REF2) U65.5(VS) U65.6(REF2) 编码器1.2 编码器2.2
VCC_BAT: C44.2 C94.2 C95.2 C96.2 C97.2 C133.2 C134.2 C135.2 C136.2 C137.2 C142.2 C155.2 C156.2 C157.2 C158.2 C159.2 C160.2 C161.2 C162.2 C163.2 C164.2 CN6.2(+) D29.2(A) D30.2(A) Q25.5(D) Q25.6(D) Q25.7(D) Q25.8(D) Q25.9(D) Q27.5(D) Q27.6(D) Q27.7(D) Q27.8(D) Q27.9(D) Q29.5(D) Q29.6(D) Q29.7(D) Q29.8(D) Q29.9(D) Q31.5(D) Q31.6(D) Q31.7(D) Q31.8(D) Q31.9(D) U10.3(VIN)
EN-IN_2: R90.1 R175.2 U11.9(3A)
EN-IN_3: R173.2 R186.1 U11.5(2A)
EN_2: U11.8(3Y) U60.14(EN)
EN_3: U11.6(2Y) U64.14(EN)
ENCODER_DIR_2: H1.4 U58.6 编码器1.4
ENCODER_DIR_3: H2.4 U58.8 编码器2.4
ENCODER_STL_2: H1.3 U58.5 编码器1.3
ENCODER_STL_3: H2.3 U58.7 编码器2.3
ENIN_2: R90.2 U58.2
ENIN_3: R186.2 U58.12
GH1_2: Q27.4(G) U60.17(GH1)
GH1_3: Q31.4(G) U64.17(GH1)
GH2_2: Q25.4(G) U60.24(GH2)
GH2_3: Q29.4(G) U64.24(GH2)
GL1_2: Q28.4(G) U60.19(GL1)
GL1_3: Q32.4(G) U64.19(GL1)
GL2_2: Q26.4(G) U60.22(GL2)
GL2_3: Q30.4(G) U64.22(GL2)
I_OUT_2: C167.2 D31.1(A) R196.2 U58.3
I_OUT_3: C168.2 D32.1(A) R197.2 U58.10
IIN_2: R189.1 U61.3(IN-) U62.2
IIN_3: R190.1 U65.3(IN-) U66.2
NSLEEP: R69.2 SW4.3 U60.13(nSLEEP) U64.13(nSLEEP)
PH-IN_2: R89.1 R176.2 U11.12(4A)
PH-IN_3: R174.2 R185.1 U11.2(1A)
PH_2: U11.11(4Y) U60.15(PH)
PH_3: U11.3(1Y) U64.15(PH)
PHIN_2: R89.2 U58.1
PHIN_3: R185.2 U58.11
SH1_2: Q27.1(S) Q27.2(S) Q27.3(S) Q28.5(D) Q28.6(D) Q28.7(D) Q28.8(D) Q28.9(D) R189.2 U60.18(SH1) U61.2(IN+)
SH1_3: Q31.1(S) Q31.2(S) Q31.3(S) Q32.5(D) Q32.6(D) Q32.7(D) Q32.8(D) Q32.9(D) R190.2 U64.18(SH1) U65.2(IN+)
SH2_2: Q25.1(S) Q25.2(S) Q25.3(S) Q26.5(D) Q26.6(D) Q26.7(D) Q26.8(D) Q26.9(D) U60.23(SH2) U62.1
SH2_3: Q29.1(S) Q29.2(S) Q29.3(S) Q30.5(D) Q30.6(D) Q30.7(D) Q30.8(D) Q30.9(D) U64.23(SH2) U66.1
SP_2: Q26.1(S) Q26.2(S) Q26.3(S) Q28.1(S) Q28.2(S) Q28.3(S) R191.1 U60.21(SP)
SP_3: Q30.1(S) Q30.2(S) Q30.3(S) Q32.1(S) Q32.2(S) Q32.3(S) R192.1 U64.21(SP)
$2N2594: LED4.2(A) R68.1
$2N2595: LED5.2(A) R69.1
$2N9119: R179.2 R180.2 U60.12(IDRIVE)
$2N9146: R177.2 U60.9(nFAULT)
$2N9165: C143.2 C144.1 D29.1(K) U60.1(VM)
$2N9166: C145.2 U60.4(CPL)
$2N9167: C144.2 U60.2(VCP)
$2N9172: R178.2 U60.10(SNSOUT)
$2N9173: C145.1 U60.3(CPH)
$2N10141: R181.2 U64.9(nFAULT)
$2N10142: R182.2 U64.10(SNSOUT)
$2N10145: C149.2 C150.1 D30.1(K) U64.1(VM)
$2N10146: C150.2 U64.2(VCP)
$2N10147: C151.1 U64.3(CPH)
$2N10151: R183.2 R184.2 U64.12(IDRIVE)
$2N10190: C151.2 U64.4(CPL)
$2N10192: R197.1 U65.8(OUT)
$2N25091: R196.1 U61.8(OUT)

Not connected (* = marked no-connect by the designer): CN6 3 4; H1 5* 6*; H2 5* 6*; J1 1; J2 1; J4 1; J5 1; J6 1; SW4 1* 4; U56 1* 3 4; U57 1* 2* 3* 4* 5* 6* 7* 8* 9* 10* 11* 12*; U60 11(SO)*; U64 11(SO)*; 编码器1 5* 6*; 编码器2 5* 6*

## Notes on the sheets
sheet 2
- 配置为双向模式
- 配置为双向模式
- 输入电源
- 输入电源
- 保护电路
- H桥驱动2
- H桥驱动3
- 驱动单片机接口
- 指示灯开关
- H桥2
- H桥3
